# EAGLE design team_flagNEW (EAGLE 6.5.0)
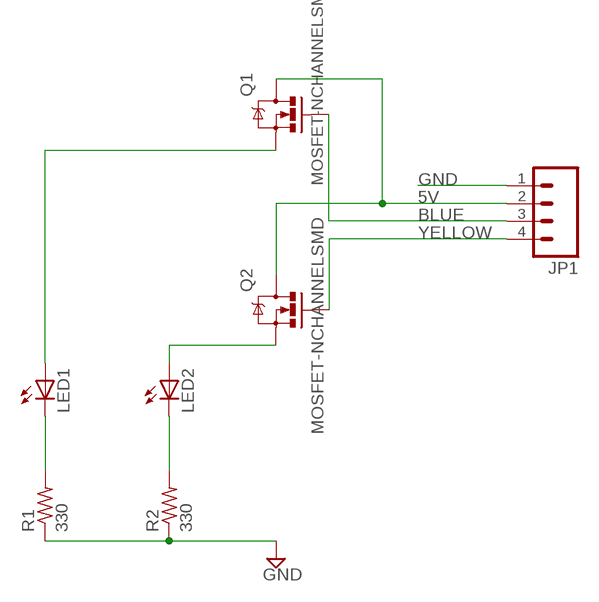
[diagram p0: schematic, sheet 1]

## Parts
JP1  M04PTH  [1X04]
LED1  LED5MM  [LED5MM]
LED2  LED5MM  [LED5MM]
Q1  MOSFET-NCHANNELSMD  [SOT23-3]
Q2  MOSFET-NCHANNELSMD  [SOT23-3]
R1  330  R-US_R0603  [R0603]
R2  330  R-US_R0603  [R0603]

## Nets
5V: JP1.2 Q1.3(D) Q2.3(D)
BDRAIN: LED1.K(C) R1.2
BLUE: JP1.3 Q1.1(G)
BSIGNAL: LED1.A Q1.2(S)
GND: JP1.1 R1.1 R2.1
YDRAIN: LED2.K(C) R2.2
YELLOW: JP1.4 Q2.1(G)
YSIGNAL: LED2.A Q2.2(S)

## Library data of the parts
JP1 = pie:M04: 4-pin 0.1-inch header and MTA connector
LED1 LED2 = led:LED: LED OSRAM: - CHIPLED LG R971, LG N971, LY N971, LG Q971, LY Q971, LO R971, LY R971 LH N974, LH R974 LS Q976, LO Q976, LY Q976 LO Q996 - Hyper CHIPLED LW Q18S LB Q993, LB Q99A, LB R99A - SideLED LS A670, LO A670, LY A670, LG A670, LP A670 LB A673, LV A673, LT A673, LW A673 LH A674 LY A675 LS A676, LA A676, LO A676, LY A676, LW A676 LS A679, LY A679, LG A679 - Hyper Micro SIDELED® LS Y876, LA Y876, LO Y876, LY Y876 LT Y87S - SmartLED LW L88C, LW L88S LB L89C, LB L89S, LG L890 LS L89K, LO L89K, LY L89K LS L896, LA L896, LO L896, LY L896 - TOPLED LS T670, LO T670, LY T670, LG T670, LP T670 LSG T670, LSP T670, LSY T670, LOP T670, LYG T670 LG T671, LOG T671, LSG T671 LB T673, LV T673, LT T673, LW T673 LH T674 LS T676, LA T676, LO T676, LY T676, LB T676, LH T676, LSB T676, LW T676 LB T67C, LV T67C, LT T67C, LS T67K, LO T67K, LY T67K, LW E67C LS E67B, LA E67B, LO E67B, LY E67B, LB E67C, LV E67C, LT E67C LW T67C LS T679, LY T679, LG T679 LS T770, LO T770, LY T770, LG T770, LP T770 LB T773, LV T773, LT T773, LW T773 LH T774 LS E675, LA E675, LY E675, LS T675 LS T776, LA T776, LO T776, LY T776, LB T776 LHGB T686 LT T68C, LB T68C - Hyper Mini TOPLED® LB M676 - Mini TOPLED Santana® LG M470 LS M47K, LO M47K, LY M47K Source: http://www.osram.convergy.de LUXEON: - LUMILED® LXK2-PW12-R00, LXK2-PW12-S00, LXK2-PW14-U00, LXK2-PW14-V00 LXK2-PM12-R00, LXK2-PM12-S00, LXK2-PM14-U00 LXK2-PE12-Q00, LXK2-PE12-R00, LXK2-PE12-S00, LXK2-PE14-T00, LXK2-PE14-U00 LXK2-PB12-K00, LXK2-PB12-L00, LXK2-PB12-M00, LXK2-PB14-N00, LXK2-PB14-P00, LXK2-PB14-Q00 LXK2-PR12-L00, LXK2-PR12-M00, LXK2-PR14-Q00, LXK2-PR14-R00 LXK2-PD12-Q00, LXK2-PD12-R00, LXK2-PD12-S00 LXK2-PH12-R00, LXK2-PH12-S00 LXK2-PL12-P00, LXK2-PL12-Q00, LXK2-PL12-R00 Source: www.luxeon.com KINGBRIGHT: KA-3528ASYC Source: www.kingbright.com
Q1 Q2 = pie:MOSFET-NCHANNEL: N-Type MOSFET, SOT23-3 Package
R1 R2 = rcl:R-US_: RESISTOR, American symbol

## Board
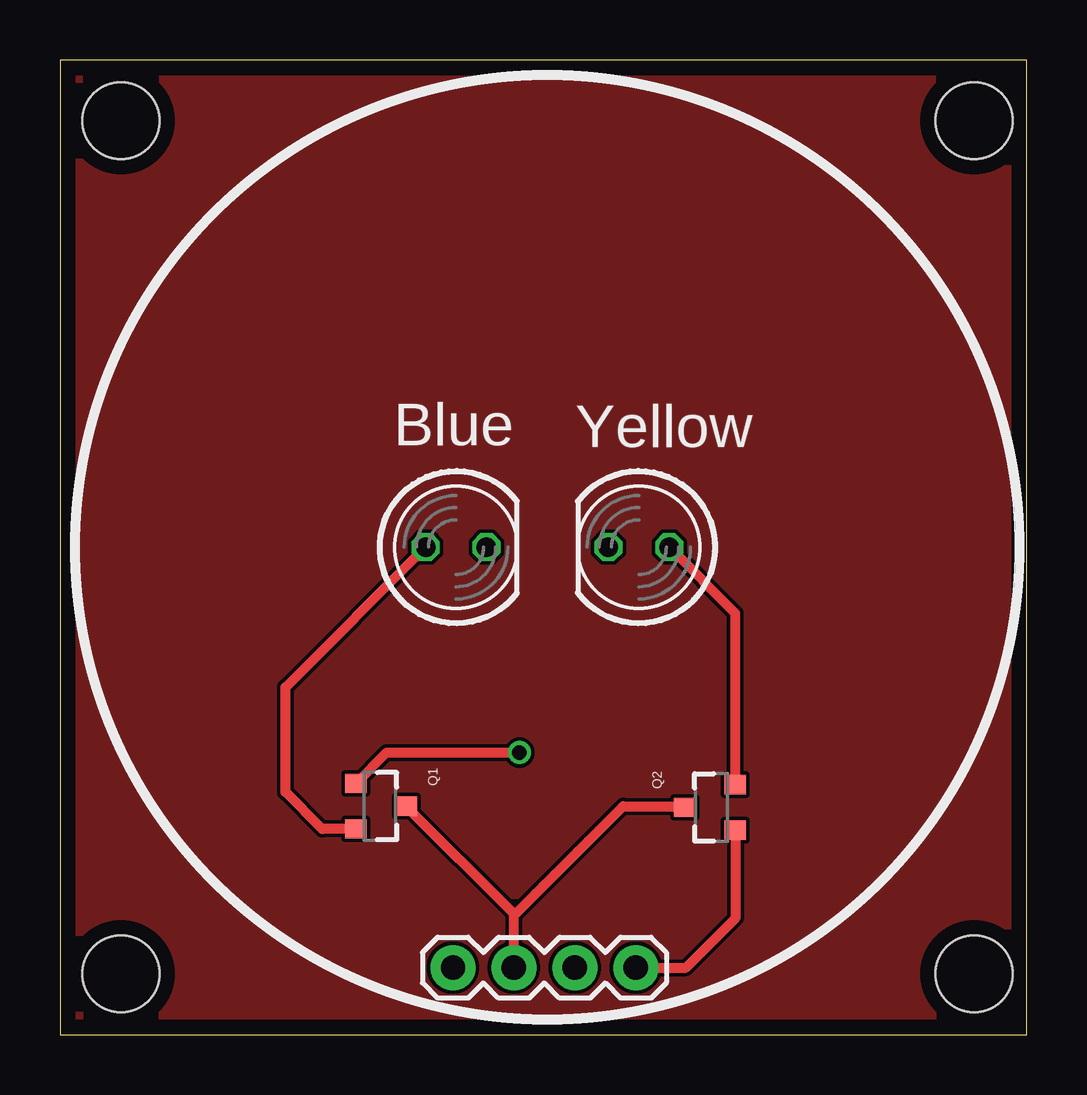
[diagram p1: board, top side]
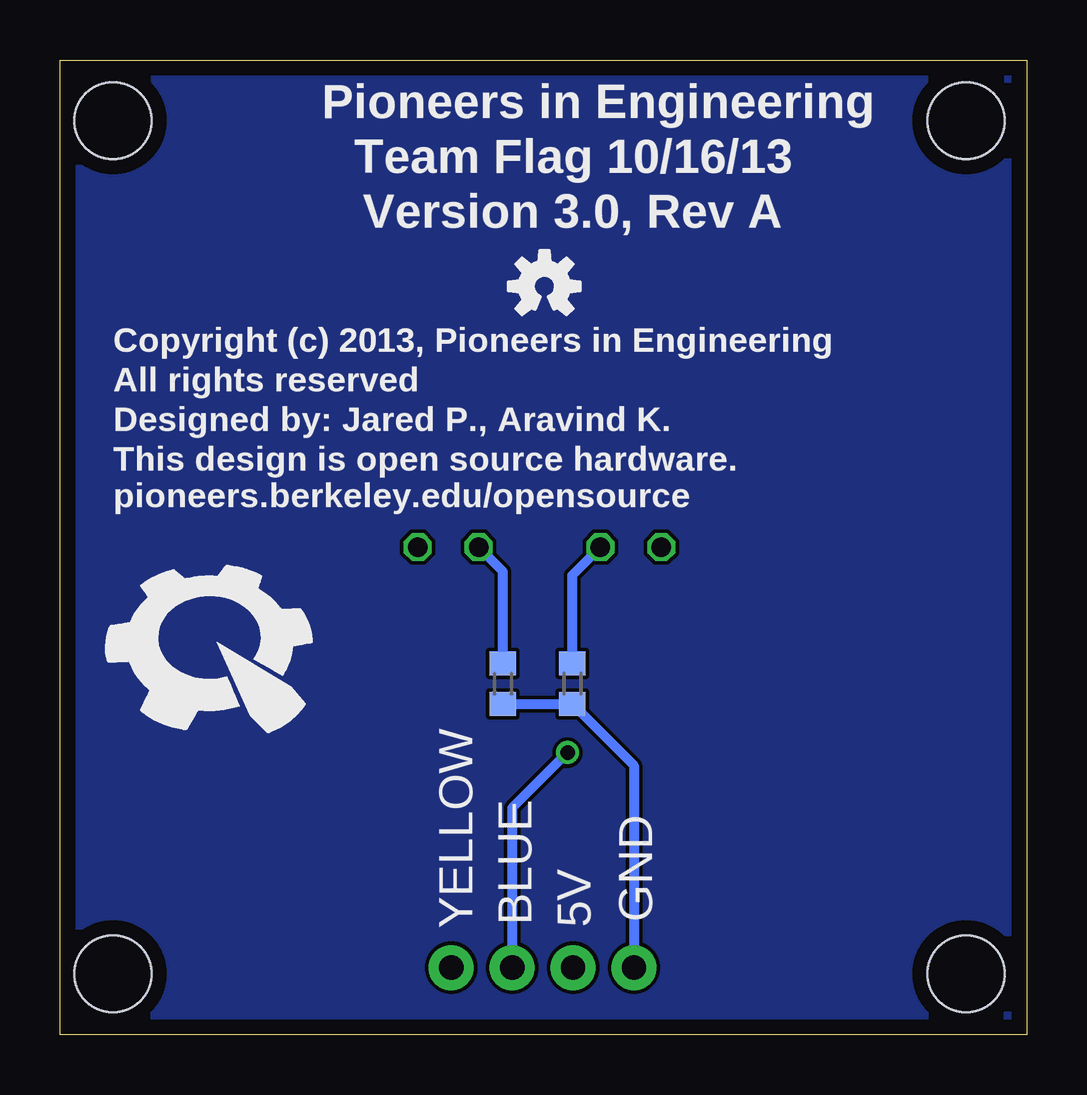
[diagram p2: board, bottom side, seen from below]

Size 40.31 x 40.63 mm. Coordinates in mm from the lower left corner, seen from the top.
Outline: 0,0 40.31,0 40.31,40.63 0,40.63 0,0
Copper layers (1*16): Top 2mil / dielectric 9mil / Bottom 2mil
Design rules "advancedcircuits-33each-pie": minimum track width 6mil, minimum drill 15mil, track to track 6mil, track to pad 10mil, pad to pad 6mil, via to via 6mil, smd to smd 6mil, copper to edge 25mil, drill to drill 7mil, minimum pad ring 7mil, minimum via ring 7mil, stop-mask expansion 3mil, vias tented up to drill 0mil, thermal gap 10mil
Holes 3.2 mm at 2.54,38.1 2.54,2.54 38.1,2.54 38.1,38.1

### Footprints (pad centres in the part's own frame; a part is rotated, then mirrored left to right if it is on the bottom)
1X04 = drill 1.016 pad 1.88: 1 -3.81,0; 2 -1.27,0; 3 1.27,0; 4 3.81,0
LED5MM = drill 0.813 octagon: A -1.27,0; K 1.27,0
SOT23-3 = smd 0.8 x 0.9: 1 -0.95,-1; 2 0.95,-1; 3 0,1.1
R0603 = smd 1 x 1.1: 1 -0.85,0; 2 0.85,0

### Placement (x,y rotation side)
JP1  20.19,2.79 0 top
LED1  16.51,20.32 0 top
LED2  24.13,20.32 180 top
Q1  13.34,9.53 270 top
Q2  27.15,9.47 90 top
R1  18.95,14.63 90 bottom
R2  21.84,14.63 90 bottom
U$1  [PIE-LOGO-SMALL]  33.78,16.38 0 bottom
U$2  [OSHW-LOGO-S]  20.12,31.19 0 bottom

### Tracks (layer width: path | path; a pad name or v marks a point on that pad's centre or on a via)
5V
  Top 0.406: 25.6,9.47 Q2.3 26,9.53 23.47,9.53 18.92,4.98 JP1.2 18.92,5.04 Q1.3
BDRAIN
  Bottom 0.406: R1.2 18.95,19.15 LED1.K
BLUE  (via drill 0.6)
  Top 0.406: Q1.1 13.62,11.76 v19.15,11.76
  Bottom 0.406: v19.15,11.76 21.46,9.45 JP1.3
BSIGNAL
  Top 0.406: Q1.2 10.93,8.57 9.4,10.11 9.4,14.48 LED1.A
GND
  Bottom 0.406: R2.1 R1.1 16.38,11.21 JP1.1
NOTHING
  pour Top: 0,0 40.26,0 40.26,40.64 0,40.64
  pour Bottom: 0,0 40.26,0 40.26,40.64 0,40.64
YDRAIN
  Bottom 0.406: R2.2 21.84,19.3 LED2.K
YELLOW
  Top 0.406: JP1.4 26.09,2.79 28.17,4.88 28.17,8.51 Q2.1
YSIGNAL
  Top 0.406: Q2.2 28.15,17.57 LED2.A

### Text on the board
tPlace: Blue | Yellow
bPlace: Pioneers in Engineering | Team Flag 10/16/13 | Version 3.0, Rev A | Copyright (c) 2013, Pioneers in Engineering | All rights reserved | Designed by: Jared P., Aravind K. | This design is open source hardware. | pioneers.berkeley.edu/opensource | GND | BLUE | 5V | YELLOW